# Altium schematic sheet MCU_ESC.SchDoc
size A4; Organization: Altium Limited; Address1: L3, 12a Rodborough Rd; Address2: Frenchs Forest; Address3: NSW; Address4: Australia 2086
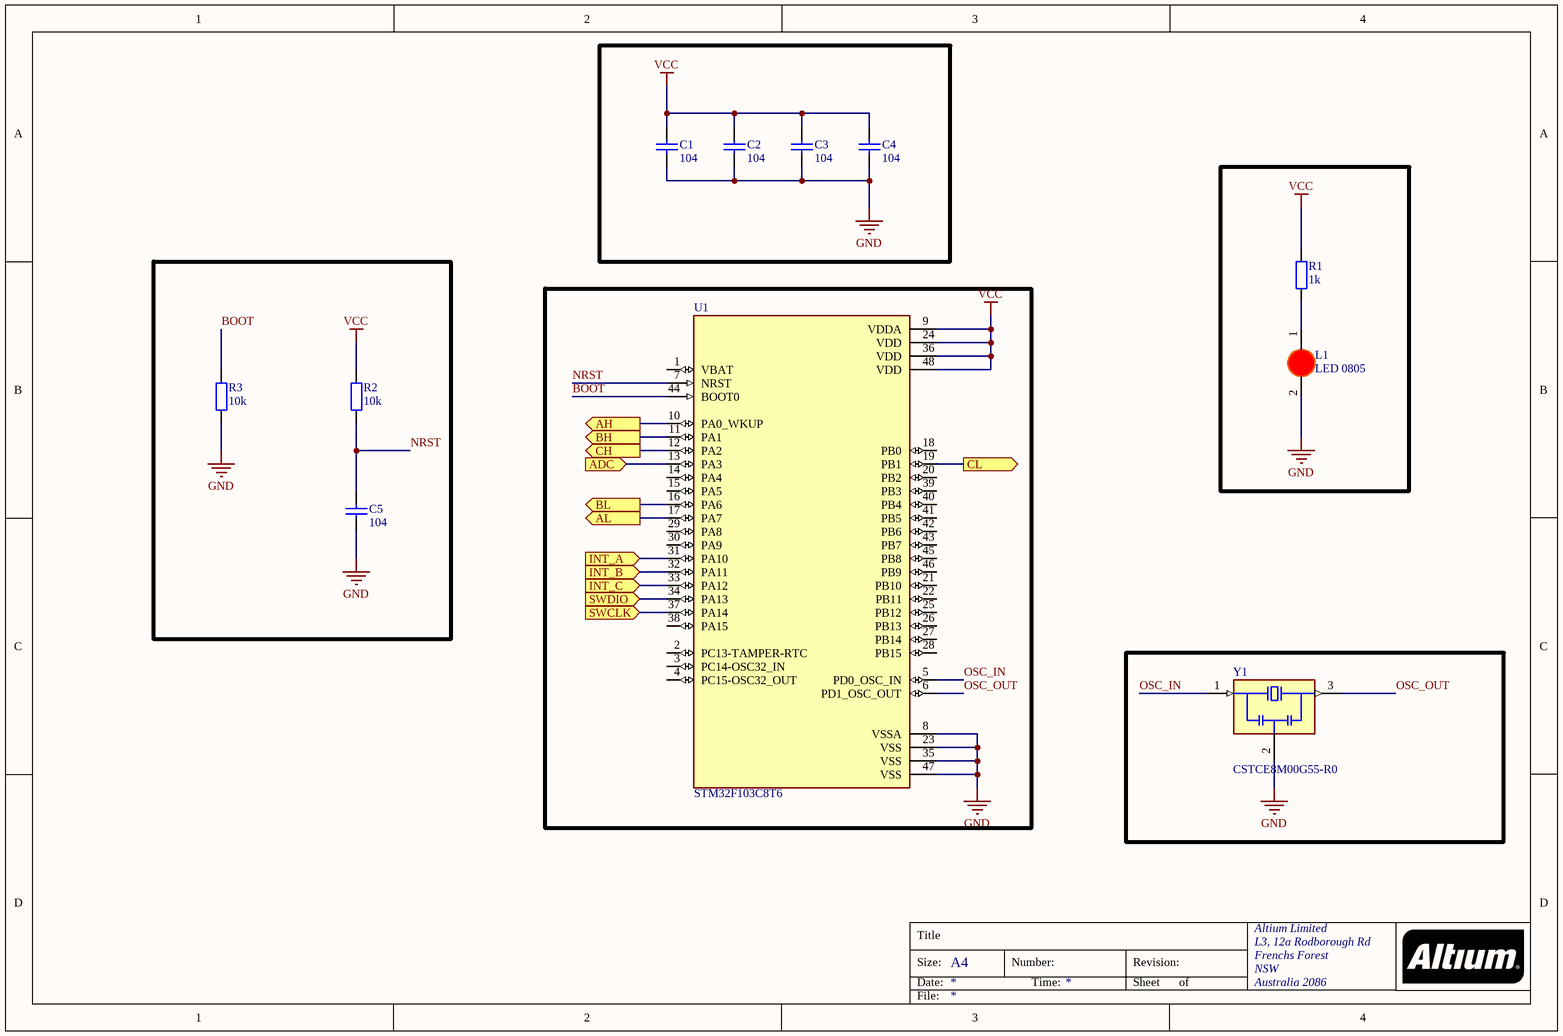
[diagram p0: MCU_ESC.SchDoc]

## Parts
C1  104  [tu 0805]
C2  104  [tu 0805]
C3  104  [tu 0805]
C4  104  [tu 0805]
C5  104  [tu 0805]
L1  LED 0805  [LED-0805-Red]
R1  1k  [tro smd 0603]
R2  10k  [tro smd 0805]
R3  10k  [tro smd 0805]
U1  STM32F103C8T6  [QFP50P900X900X160-48N]
Y1  CSTCE8M00G55-R0  [OSC_CSTCE8M00G55-R0]

## Ports
ADC (in), AH (out), AL (out), BH (out), BL (out), CH (out), CL (out), INT_A (in), INT_B (in), INT_C (in), SWCLK (in), SWDIO (in)

## Nets
GND: C1.2 C2.2 C3.2 C4.2 C5.2 L1.2(K) R3.1 U1.8(VSSA) U1.23(VSS) U1.35(VSS) U1.47(VSS) Y1.2(GND)
VCC: C1.1 C2.1 C3.1 C4.1 R1.2 R2.2 U1.9(VDDA) U1.24(VDD) U1.36(VDD) U1.48(VDD)
ADC: U1.13(PA3) ; port ADC
AH: U1.10(PA0_WKUP) ; port AH
AL: U1.17(PA7) ; port AL
BH: U1.11(PA1) ; port BH
BL: U1.16(PA6) ; port BL
BOOT: R3.2 U1.44(BOOT0)
CH: U1.12(PA2) ; port CH
CL: U1.19(PB1) ; port CL
INT_A: U1.31(PA10) ; port INT_A
INT_B: U1.32(PA11) ; port INT_B
INT_C: U1.33(PA12) ; port INT_C
NRST: C5.1 R2.1 U1.7(NRST)
OSC_IN: U1.5(PD0_OSC_IN) Y1.1(IN)
OSC_OUT: U1.6(PD1_OSC_OUT) Y1.3(OUT)
SWCLK: U1.37(PA14) ; port SWCLK
SWDIO: U1.34(PA13) ; port SWDIO
NetL1_1: L1.1(A) R1.1

Not connected (* = marked no-connect by the designer): U1 1(VBAT) 2(PC13-TAMPER-RTC) 3(PC14-OSC32_IN) 4(PC15-OSC32_OUT) 14(PA4) 15(PA5) 18(PB0) 20(PB2) 21(PB10) 22(PB11) 25(PB12) 26(PB13) 27(PB14) 28(PB15) 29(PA8) 30(PA9) 38(PA15) 39(PB3) 40(PB4) 41(PB5) 42(PB6) 43(PB7) 45(PB8) 46(PB9)

## Notes on the sheet
- Title
- Size:
- Date:
- A4
- Number:
- Time:
- Revision:
- Sheet
- of
- File:

## Library data of the parts
C1-C5 = Tu 0805 104 50V 10%: Dán; Don_Vi: Con; So_Chan: 2; Ten_Linh_Kien: Tụ 0805 104-100nF 10% 50V; Ma_Hang: MH004551; Chung_Loai: Dán; Kieu_Chan: *
L1 = LED 0805 Do: Dán; Don_Vi: Con; Ma_Hang: MH000897; Ten_Linh_Kien: LED 0805 Màu Đỏ (Red); Ghi_Chu: *; Kieu_Chan: *; Chung_Loai: Dán
R1 = Tro 0603 1% 1k: Dán; So_Chan: 2; Don_Vi: Con; Ten_Linh_Kien: Trở 0603 1% 1k; Ma_Hang: MH006334; Chung_Loai: Dán; Kieu_Chan: *
R2 R3 = Tro 0805 1% 10k: Dán; Don_Vi: Con; So_Chan: 2; Ten_Linh_Kien: Trở 0805 1% 10k; Ma_Hang: MH005473; Chung_Loai: Dán; Kieu_Chan: *
U1 = STM32F103C8T6: ARMÂ® CortexÂ®-M3 STM32F1 Microcontroller IC 32-Bit 72MHz 64KB (64K x 8) FLASH 48-LQFP (7x7); MF: STMicroelectronics; Package: LQFP-48 STMicroelectronics; Price: None; Check_prices: https://www.snapeda.com/parts/STM32F103C8T6/STMicroelectronics/view-part/?ref=eda; Value: *; SnapEDA_Link: https://www.snapeda.com/parts/STM32F103C8T6/STMicroelectronics/view-part/?ref=snap; MP: STM32F103C8T6; Availability: In Stock; Purchase-URL: https://pricing.snapeda.com/search/part/STM32F103C8T6/?ref=eda
Y1 = CSTCE8M00G55-R0: 8 MHz Ceramic Resonator Built in Capacitor 33 pF Â±0.2% -20Â°C ~ 80Â°C Surface Mount; MF: Murata; SnapEDA_Link: https://www.snapeda.com/parts/CSTCE8M00G55-R0/Murata+Electronics+North+America/view-part/?ref=snap; Package: SMD-3 Murata; Value: *; MP: CSTCE8M00G55-R0; Check_prices: https://www.snapeda.com/parts/CSTCE8M00G55-R0/Murata+Electronics+North+America/view-part/?ref=eda